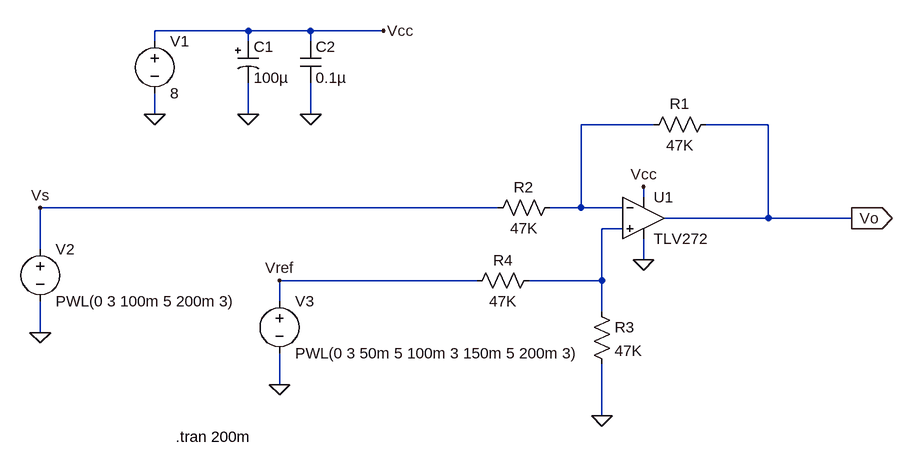
[diagram p0: schematic EXP3.B.2 Making the Case for Virtual Ground.asc]
EXP3.B.2 Making the Case for Virtual Ground.asc, the LTspice schematic file:
Version 4
SHEET 1 1112 680
WIRE 96 -32 -48 -32
WIRE 192 -32 96 -32
WIRE 304 -32 192 -32
WIRE -48 -16 -48 -32
WIRE 96 -16 96 -32
WIRE 192 -16 192 -32
WIRE -48 96 -48 64
WIRE 96 96 96 48
WIRE 192 96 192 48
WIRE 720 112 608 112
WIRE 896 112 800 112
WIRE 704 224 704 208
WIRE 480 240 -224 240
WIRE 608 240 608 112
WIRE 608 240 560 240
WIRE 672 240 608 240
WIRE 896 256 896 112
WIRE 896 256 736 256
WIRE 1024 256 896 256
WIRE 672 272 640 272
WIRE -224 304 -224 240
WIRE 704 320 704 288
WIRE 448 352 144 352
WIRE 640 352 640 272
WIRE 640 352 528 352
WIRE 144 384 144 352
WIRE 640 400 640 352
WIRE -224 432 -224 384
WIRE 144 512 144 464
WIRE 640 560 640 480
FLAG -48 96 0
FLAG 96 96 0
FLAG 192 96 0
FLAG 304 -32 Vcc
FLAG -224 432 0
FLAG 144 512 0
FLAG 640 560 0
FLAG -224 240 Vs
FLAG 144 352 Vref
FLAG 1024 256 Vo
IOPIN 1024 256 Out
FLAG 704 208 Vcc
FLAG 704 320 0
SYMBOL voltage -48 -32 R0
SYMATTR InstName V1
SYMATTR Value 8
SYMBOL voltage -224 288 R0
WINDOW 123 0 0 Left 0
WINDOW 39 0 0 Left 0
SYMATTR InstName V2
SYMATTR Value PWL(0 3 100m 5 200m 3)
SYMBOL voltage 144 368 R0
WINDOW 123 0 0 Left 0
WINDOW 39 0 0 Left 0
SYMATTR InstName V3
SYMATTR Value PWL(0 3 50m 5 100m 3 150m 5 200m 3)
SYMBOL OpAmps\\TLV272 704 256 R0
SYMATTR InstName U1
SYMBOL res 624 384 R0
SYMATTR InstName R3
SYMATTR Value 47K
SYMBOL res 464 256 R270
WINDOW 0 32 56 VTop 2
WINDOW 3 0 56 VBottom 2
SYMATTR InstName R2
SYMATTR Value 47K
SYMBOL res 704 128 R270
WINDOW 0 32 56 VTop 2
WINDOW 3 0 56 VBottom 2
SYMATTR InstName R1
SYMATTR Value 47K
SYMBOL res 432 368 R270
WINDOW 0 32 56 VTop 2
WINDOW 3 0 56 VBottom 2
SYMATTR InstName R4
SYMATTR Value 47K
SYMBOL polcap 80 -16 R0
SYMATTR InstName C1
SYMATTR Value 100µ
SYMBOL cap 176 -16 R0
SYMATTR InstName C2
SYMATTR Value 0.1µ
TEXT -16 592 Left 2 !.tran 200m

The netlist it stands for:
* EXP3.B.2 Making the Case for Virtual Ground.asc
V1 Vcc 0 8
V2 Vs 0 PWL(0 3 100m 5 200m 3)
V3 Vref 0 PWL(0 3 50m 5 100m 3 150m 5 200m 3)
* U1: TLV272 (symbol OpAmps\TLV272 not available, pins judged from their places): In+=N002 In-=N001 V+=Vcc V-=0 OUT=Vo
R3 N002 0 47K
R2 Vs N001 47K
R1 N001 Vo 47K
R4 Vref N002 47K
C1 Vcc 0 100µ
C2 Vcc 0 0.1µ
.tran 200m
.backanno
.end